# Altium project LandiAndras_21.PrjPcb
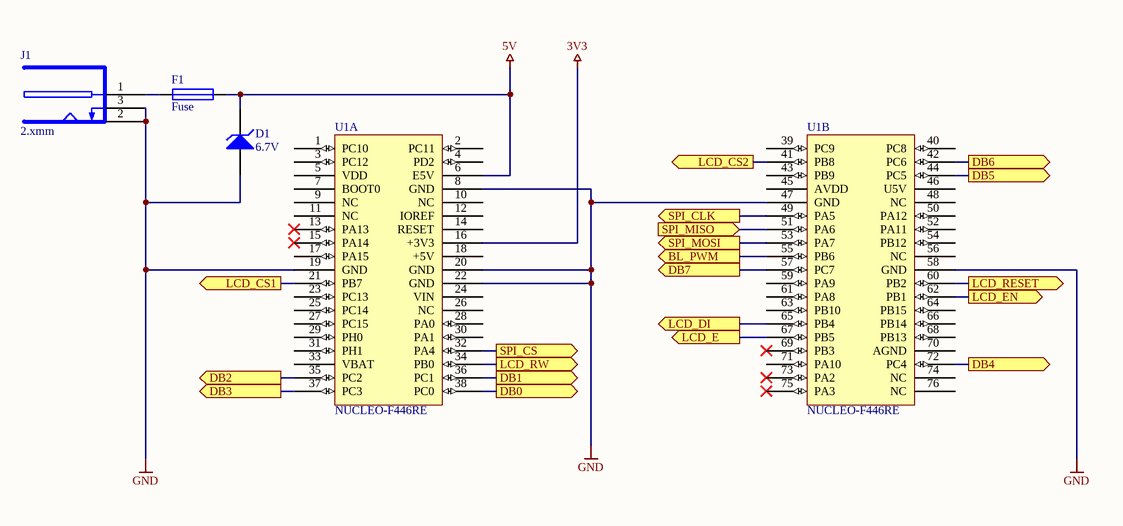
[diagram p0: Nucleo.SchDoc]
3 sheets, 17 parts. Net scope: flat (ports and power ports of the same name join across sheets).
Board file: vizmertekpcb.PcbDoc
Sheets:
  Nucleo.SchDoc
  kijelzo.SchDoc
  gyorsulasmero.SchDoc

## Sheet Nucleo.SchDoc: Nucleo
size A4; Author: Landi András; Organization: BME AUT; Address1: Magyar tudósok krt. 2.; Address2: Q épület; Address3: Budapest; Address4: H-1117; DocumentNumber: 1; Revision: 21; SheetNumber: 1; SheetTotal: 3

### Parts
D1  6.7V  [FP_SMA]
F1  Fuse  [FP_MULTIFUSE]
J1  2.xmm  [FP_DC_TAP_ANYA]
U1  NUCLEO-F446RE  [FP_NUCLEO-64_2x20]  (parts A,B of 2)

### Ports
BL_PWM (out), DB0 (out), DB1 (out), DB2 (out), DB3 (out), DB4 (out), DB5 (out), DB6 (out), DB7 (out), LCD_CS1 (out), LCD_CS2 (out), LCD_DI (out), LCD_E (out), LCD_EN (out), LCD_RESET (out), LCD_RW (out), SPI_CLK (out), SPI_CS (out), SPI_MISO (in), SPI_MOSI (out)

### Nets
3V3: U1.16(+3V3)
5V: D1.2(K) F1.2 U1.6(E5V)
GND: D1.1(A) J1.2(SLEEVE) J1.3(BREAK) U1.8(GND) U1.19(GND) U1.20(GND) U1.22(GND) U1.47(GND) U1.58(GND)
NetF1_1: F1.1 J1.1(PIN)
NetR1_1: U1.62(PB1) ; port LCD_EN
NetR5_2: U1.55(PB6) ; port BL_PWM
NetU1_21: U1.21(PB7) ; port LCD_CS1
NetU1_32: U1.32(PA4) ; port SPI_CS
NetU1_34: U1.34(PB0) ; port LCD_RW
NetU1_35: U1.35(PC2) ; port DB2
NetU1_36: U1.36(PC1) ; port DB1
NetU1_37: U1.37(PC3) ; port DB3
NetU1_38: U1.38(PC0) ; port DB0
NetU1_41: U1.41(PB8) ; port LCD_CS2
NetU1_42: U1.42(PC6) ; port DB6
NetU1_44: U1.44(PC5) ; port DB5
NetU1_49: U1.49(PA5) ; port SPI_CLK
NetU1_51: U1.51(PA6) ; port SPI_MISO
NetU1_53: U1.53(PA7) ; port SPI_MOSI
NetU1_57: U1.57(PC7) ; port DB7
NetU1_60: U1.60(PB2) ; port LCD_RESET
NetU1_65: U1.65(PB4) ; port LCD_DI
NetU1_67: U1.67(PB5) ; port LCD_E
NetU1_72: U1.72(PC4) ; port DB4

Not connected (* = marked no-connect by the designer): U1 1(PC10) 2(PC11) 3(PC12) 4(PD2) 5(VDD) 7(BOOT0) 9(NC) 10(NC) 11(NC) 12(IOREF) 13(PA13)* 14(RESET) 15(PA14)* 17(PA15) 18(+5V) 23(PC13) 24(VIN) 25(PC14) 26(NC) 27(PC15) 28(PA0) 29(PH0) 30(PA1) 31(PH1) 33(VBAT) 39(PC9) 40(PC8) 43(PB9) 45(AVDD) 46(U5V) 48(NC) 50(PA12) 52(PA11) 54(PB12) 56(NC) 59(PA9) 61(PA8) 63(PB10) 64(PB15) 66(PB14) 68(PB13) 69(PB3)* 70(AGND) 71(PA10) 73(PA2)* 74(NC) 75(PA3)* 76(NC)

### Notes on the sheet
- Title
- Size:
- Date:
- A4
- Number:
- Time:
- Revision:
- Sheet
- of
- File:

### Library data of the parts
D1 = ZENER: Zener Diode; Reference: 9550941; Name: VISHAY SMAJ5.0A-E3/61; Supplier: Farnell; U_Z: 6.7V
F1 = Fuse: Name: 1.25A 15V 1812L125/16DR POLYFUSE SMD 1812 (LFS) ˝LF125-16˝; Reference: 44-04-71; Supplier: Lomex
J1 = DC_TAP_ANYA: 2.xmm DC HEBA25 TÁPFESZÜLTSÉG ALJZAT ZÁRT, NYÁKBA 90°; Name: TÁP DC ANYA 5.5/2.1/9.5mm DCS-5521-5; Supplier: Lomex; Reference: 43-07-67
U1 = NUCLEO-F446RE: Reference: NUCLEO; Name: Nucleo F446RE; Supplier: Tanszék

## Sheet kijelzo.SchDoc: LCD grafikus kijelzo
size A4; Author: Landi András; Organization: BME-AUT; DocumentNumber: 2; Revision: 21; SheetNumber: 2; SheetTotal: 3
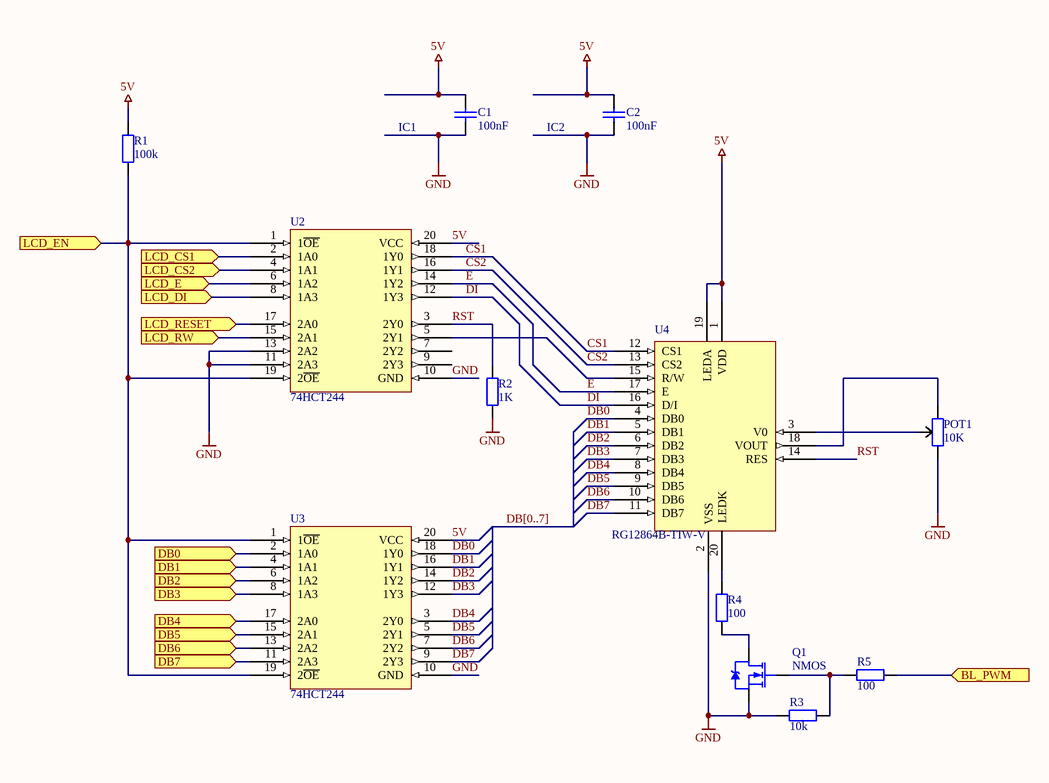
[diagram p1: kijelzo.SchDoc]

### Parts
C1  100nF  [FP_0805_CAP_085]
C2  100nF  [FP_0805_CAP_085]
POT1  10K  [potentiometer]
Q1  NMOS  [FP_SOT23-3]
R1  100k  [FP_0805_RES]
R2  1K  [FP_0805_RES]
R3  10k  [FP_0805_RES]
R4  100  [FP_0805_RES]
R5  100  [FP_0805_RES]
U2  74HCT244  [SO-20]
U3  74HCT244  [SO-20]
U4  RG12864B-TIW-V  [FP_LCD]

### Ports
BL_PWM (in), DB0 (in), DB1 (in), DB2 (in), DB3 (in), DB4 (in), DB5 (in), DB6 (in), DB7 (in), LCD_CS1 (in), LCD_CS2 (in), LCD_DI (in), LCD_E (in), LCD_EN (in), LCD_RESET (in), LCD_RW (in)

### Nets
5V: C1.2 C2.2 R1.2 U2.20(VCC) U3.20(VCC) U4.1(VDD) U4.19(LEDA)
GND: C1.1 C2.1 POT1.1 Q1.3(S) R2.1 R3.1 U2.10(GND) U2.11(2A3) U2.13(2A2) U3.10(GND) U4.2(VSS)
CS1: U2.18(1Y0) U4.12(CS1)
CS2: U2.16(1Y1) U4.13(CS2)
DB0: U3.18(1Y0) U4.4(DB0)
DB1: U3.16(1Y1) U4.5(DB1)
DB2: U3.14(1Y2) U4.6(DB2)
DB3: U3.12(1Y3) U4.7(DB3)
DB4: U3.3(2Y0) U4.8(DB4)
DB5: U3.5(2Y1) U4.9(DB5)
DB6: U3.7(2Y2) U4.10(DB6)
DB7: U3.9(2Y3) U4.11(DB7)
DI: U2.12(1Y3) U4.16(D/I)
E: U2.14(1Y2) U4.17(E)
RST: R2.2 U2.3(2Y0) U4.14(RES)
NetPOT1_2: POT1.2 U4.3(V0)
NetPOT1_3: POT1.3 U4.18(VOUT)
NetQ1_1: Q1.1(G) R3.2 R5.1
NetQ1_2: Q1.2(D) R4.1
NetR1_1: R1.1 U2.1(1~{OE}) U2.19(2~{OE}) U3.1(1~{OE}) U3.19(2~{OE}) ; port LCD_EN
NetR4_2: R4.2 U4.20(LEDK)
NetR5_2: R5.2 ; port BL_PWM
NetU1_21: U2.2(1A0) ; port LCD_CS1
NetU1_34: U2.15(2A1) ; port LCD_RW
NetU1_35: U3.6(1A2) ; port DB2
NetU1_36: U3.4(1A1) ; port DB1
NetU1_37: U3.8(1A3) ; port DB3
NetU1_38: U3.2(1A0) ; port DB0
NetU1_41: U2.4(1A1) ; port LCD_CS2
NetU1_42: U3.13(2A2) ; port DB6
NetU1_44: U3.15(2A1) ; port DB5
NetU1_57: U3.11(2A3) ; port DB7
NetU1_60: U2.17(2A0) ; port LCD_RESET
NetU1_65: U2.8(1A3) ; port LCD_DI
NetU1_67: U2.6(1A2) ; port LCD_E
NetU1_72: U3.17(2A0) ; port DB4
NetU2_5: U2.5(2Y1) U4.15(R/W)

Not connected (* = marked no-connect by the designer): U2 7(2Y2) 9(2Y3)

### Buses and harness runs
bus DB[0..7]

### Notes on the sheet
- (near C1) IC1
- (near C2) IC2
- Title
- Size:
- Date:
- A4
- Number:
- Time:
- Revision:
- Sheet
- of
- File:

### Library data of the parts
C1 = CAP: Capacitor; Tolerance: 10%; Voltage: 50V; Name: 100nF 0805 10% 50V X7R 0805B104K500NT; Supplier: Lomex; Reference: 82-13-46; Value: 100nF
C2 = CAP: Capacitor; Tolerance: 10%; Voltage: 50V; Name: 100nF 0805 10% 50V X7R 0805B104K500NT (FNG); Supplier: Lomex; Reference: 82-13-46; Value: 100nF
POT1 = POT: Potentiometer; Tolerance: 10%; Power: 0.5W; Name: 10K0 3296W-1-103R (KIC) HELI 25turn CERMET; Supplier: Lomex; Reference: 05-05-89; Value: 10K
Q1 = NMOS: NXP - BSP030,115 - MOSFET, N CH, 30V, 10A, SOT223; pin to pad: 2>3 3>2; Name: TSM2302CX (TSC) N-POWERFET 20V 3.2A Rds<0.065R Qg=7.8nC SOT-23 (SI2302); Supplier: Lomex; Reference: 86-02-83
R1 = RES: Resistor; Tolerance: 5%; Power: 0.125W; Name: 100K 0805 1% CR-05FL7--100K 0.125W (VIK); Supplier: Lomex; Reference: 80-11-10; Value: 100k
R2 = RES: Resistor; Tolerance: 5%; Power: 0.125W; Name: 1K00 0805 1% CR-05FL7----1K 0.125W (VIK); Supplier: Lomex; Reference: 80-10-86; Value: 1K
R3 = RES: Resistor; Tolerance: 1%; Power: 0.125W; Name: 10K0 0805 1% CR-05FL7---10K 0.125W (VIK); Supplier: Lomex; Reference: 80-10-98; Value: 10k
R4 R5 = RES: Resistor; Tolerance: 1%; Power: 0.125W; Name: 100R 0805 1% CR-05FL7--100R 0.125W (VIK); Supplier: Lomex; Reference: 80-10-74; Value: 100
U2 U3 = 74HCT244: Name: 74HCT244D,653 (NXP) 8xBUFFER/LINE DRIVER 3-STATE OUTPUT SO-20 WIDE; Supplier: Lomex; Reference: 87-00-95
U4 = LCD: Name: RG12864B-TIW-VRAYSTAR OPTRONICS; Supplier: TME; Reference: RG12864B-TIW-V

## Sheet gyorsulasmero.SchDoc: Gyorsulasmero
size A4; Author: Landi András; Organization: BME-AUT; DocumentNumber: 3; Revision: 21; SheetNumber: 3; SheetTotal: 3
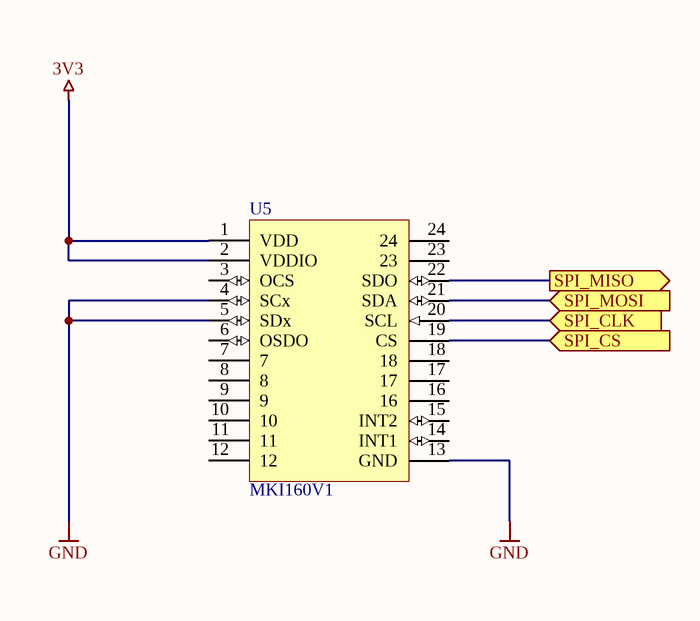
[diagram p2: gyorsulasmero.SchDoc]

### Parts
U5  MKI160V1  [FP_DIL24]

### Ports
SPI_CLK (in), SPI_CS (in), SPI_MISO (out), SPI_MOSI (in)

### Nets
3V3: U5.1(VDD) U5.2(VDDIO)
GND: U5.4(SCx) U5.5(SDx) U5.13(GND)
NetU1_32: U5.19(CS) ; port SPI_CS
NetU1_49: U5.20(SCL) ; port SPI_CLK
NetU1_51: U5.22(SDO) ; port SPI_MISO
NetU1_53: U5.21(SDA) ; port SPI_MOSI

Not connected (* = marked no-connect by the designer): U5 3(OCS) 6(OSDO) 7 8 9 10 11 12 14(INT1) 15(INT2) 16 17 18 23 24

### Notes on the sheet
- Title
- Size:
- Date:
- A4
- Number:
- Time:
- Revision:
- Sheet
- of
- File:

### Library data of the parts
U5 = MKI160V1: LSM6DS3 inertial module adapter; Name: MKI160V1 LSM6DS3 inertial module adapter; Reference: 511-STEVAL-MKI160V1; Supplier: Mouser

## Nets that join several sheets
3V3: Nucleo (U1.16), gyorsulasmero (U5.1 U5.2)
5V: Nucleo (D1.2 F1.2 U1.6), kijelzo (7 pins)
GND: Nucleo (9 pins), kijelzo (11 pins), gyorsulasmero (U5.4 U5.5 U5.13)
NetR1_1: Nucleo (U1.62), kijelzo (5 pins)
NetR5_2: Nucleo (U1.55), kijelzo (R5.2)
NetU1_21: Nucleo (U1.21), kijelzo (U2.2)
NetU1_32: Nucleo (U1.32), gyorsulasmero (U5.19)
NetU1_34: Nucleo (U1.34), kijelzo (U2.15)
NetU1_35: Nucleo (U1.35), kijelzo (U3.6)
NetU1_36: Nucleo (U1.36), kijelzo (U3.4)
NetU1_37: Nucleo (U1.37), kijelzo (U3.8)
NetU1_38: Nucleo (U1.38), kijelzo (U3.2)
NetU1_41: Nucleo (U1.41), kijelzo (U2.4)
NetU1_42: Nucleo (U1.42), kijelzo (U3.13)
NetU1_44: Nucleo (U1.44), kijelzo (U3.15)
NetU1_49: Nucleo (U1.49), gyorsulasmero (U5.20)
NetU1_51: Nucleo (U1.51), gyorsulasmero (U5.22)
NetU1_53: Nucleo (U1.53), gyorsulasmero (U5.21)
NetU1_57: Nucleo (U1.57), kijelzo (U3.11)
NetU1_60: Nucleo (U1.60), kijelzo (U2.17)
NetU1_65: Nucleo (U1.65), kijelzo (U2.8)
NetU1_67: Nucleo (U1.67), kijelzo (U2.6)
NetU1_72: Nucleo (U1.72), kijelzo (U3.17)